# Altium schematic sheet 8_dc_dc_5V_5A_Radio.SchDoc: Radios Step-Down Converters 5V/3A
size A4; DrawnBy: Sara V. Martínez; Engineer: Flight; DocumentNumber: 11; Revision: V0.1; SheetNumber: 11; SheetTotal: 11
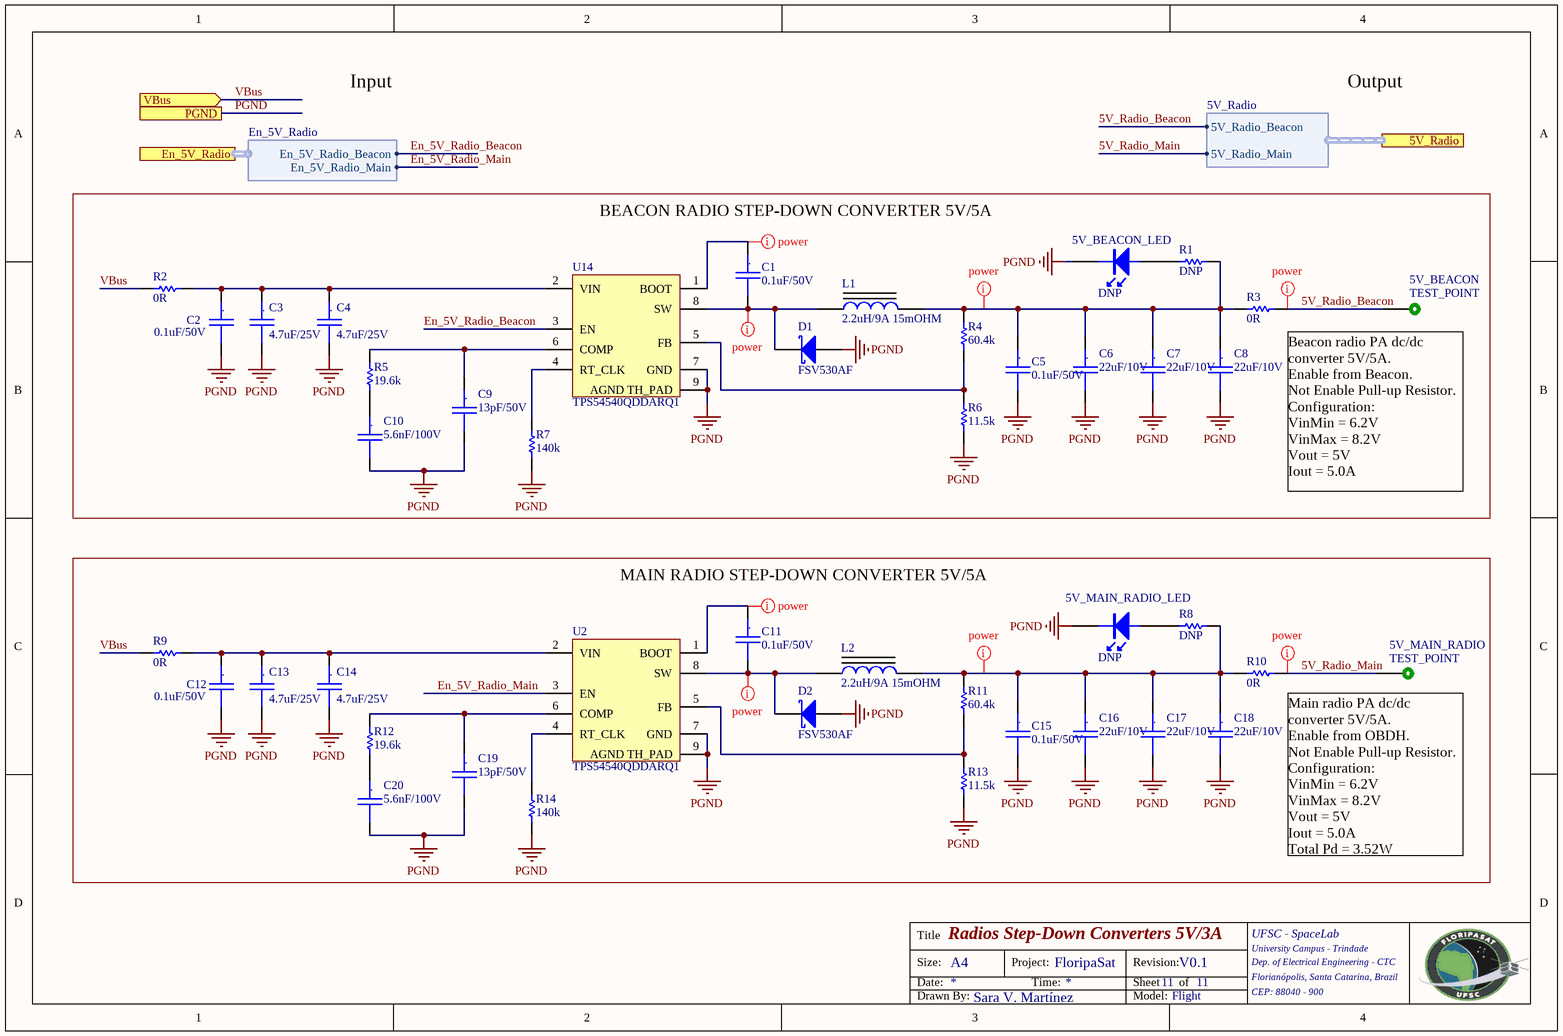
[diagram p0: 8_dc_dc_5V_5A_Radio.SchDoc]

## Parts
5V_BEACON  TEST_POINT  [TEST_POINT]  (no BOM)
5V_BEACON_LED  DNP  [0603-LED]
5V_MAIN_RADIO  TEST_POINT  [TEST_POINT]  (no BOM)
5V_MAIN_RADIO_LED  DNP  [0603-LED]
C1  0.1uF/50V  [CC0805]
C2  0.1uF/50V  [CC0805]
C3  4.7uF/25V  [CC0805]
C4  4.7uF/25V  [CC0805]
C5  0.1uF/50V  [CC0805]
C6  22uF/10V  [CC1206]
C7  22uF/10V  [CC1206]
C8  22uF/10V  [CC1206]
C9  13pF/50V  [CC0603]
C10  5.6nF/100V  [CC0603]
C11  0.1uF/50V  [CC0805]
C12  0.1uF/50V  [CC0805]
C13  4.7uF/25V  [CC0805]
C14  4.7uF/25V  [CC0805]
C15  0.1uF/50V  [CC0805]
C16  22uF/10V  [CC1206]
C17  22uF/10V  [CC1206]
C18  22uF/10V  [CC1206]
C19  13pF/50V  [CC0603]
C20  5.6nF/100V  [CC0603]
D1  FSV530AF  [DO-214AC]
D2  FSV530AF  [DO-214AC]
L1  2.2uH/9A 15mOHM  [Ind_SRP6540]
L2  2.2uH/9A 15mOHM  [Ind_SRP6540]
R1  DNP  [0603]
R2  0R  [1206]
R3  0R  [1206]
R4  60.4k  [0805]
R5  19.6k  [0603]
R6  11.5k  [0805]
R7  140k  [0603]
R8  DNP  [0603]
R9  0R  [1206]
R10  0R  [1206]
R11  60.4k  [0805]
R12  19.6k  [0603]
R13  11.5k  [0805]
R14  140k  [0603]
U2  TPS54540QDDARQ1  [SO8 Power PAD]
U14  TPS54540QDDARQ1  [SO8 Power PAD]

## Blocks framed on the sheet
BEACON RADIO STEP-DOWN CONVERTER 5V/5A: 5V_BEACON 5V_BEACON_LED C1-C10 D1 L1 R1-R7 U14
MAIN RADIO STEP-DOWN CONVERTER 5V/5A: 5V_MAIN_RADIO 5V_MAIN_RADIO_LED C11-C20 D2 L2 R8-R14 U2

## Ports
5V_Radio (harness 5V_Radio), En_5V_Radio (harness En_5V_Radio), PGND, VBus (in)

## Harnesses
5V_Radio: 5V_Radio_Beacon, 5V_Radio_Main
En_5V_Radio: En_5V_Radio_Beacon, En_5V_Radio_Main

## Nets
PGND: 5V_BEACON_LED.2(K) 5V_MAIN_RADIO_LED.2(K) C2.2 C3.2 C4.2 C5.2 C6.2 C7.2 C8.2 C9.2 C10.2 C12.2 C13.2 C14.2 C15.2 C16.2 C17.2 C18.2 C19.2 C20.2 D1.2(A) D2.2(A) R6.1 R7.1 R13.1 R14.1 U2.7(GND) U2.9(AGND_TH_PAD) U14.7(GND) U14.9(AGND_TH_PAD) ; port PGND
5V_Radio_Beacon: 5V_BEACON.1 R3.1 ; port 5V_Radio.5V_Radio_Beacon
5V_Radio_Main: 5V_MAIN_RADIO.1 R10.1 ; port 5V_Radio.5V_Radio_Main
En_5V_Radio_Beacon: U14.3(EN) ; port En_5V_Radio.En_5V_Radio_Beacon
En_5V_Radio_Main: U2.3(EN) ; port En_5V_Radio.En_5V_Radio_Main
VBus: R2.2 R9.2 ; port VBus
Net5V_BEACON_LED_1: 5V_BEACON_LED.1(A) R1.2
Net5V_MAIN_RADIO_LED_1: 5V_MAIN_RADIO_LED.1(A) R8.2
NetC1_1: C1.1 U14.1(BOOT)
NetC1_2: C1.2 D1.1(K) L1.1 U14.8(SW)
NetC2_1: C2.1 C3.1 C4.1 R2.1 U14.2(VIN)
NetC5_1: C5.1 C6.1 C7.1 C8.1 L1.2 R1.1 R3.2 R4.2
NetC9_1: C9.1 R5.2 U14.6(COMP)
NetC10_1: C10.1 R5.1
NetC11_1: C11.1 U2.1(BOOT)
NetC11_2: C11.2 D2.1(K) L2.1 U2.8(SW)
NetC12_1: C12.1 C13.1 C14.1 R9.1 U2.2(VIN)
NetC15_1: C15.1 C16.1 C17.1 C18.1 L2.2 R8.1 R10.2 R11.2
NetC19_1: C19.1 R12.2 U2.6(COMP)
NetC20_1: C20.1 R12.1
NetR4_1: R4.1 R6.2 U14.5(FB)
NetR7_2: R7.2 U14.4(RT_CLK)
NetR11_1: R11.1 R13.2 U2.5(FB)
NetR14_2: R14.2 U2.4(RT_CLK)

## Layout directives
net class power: 5V_Radio_Beacon, 5V_Radio_Main, NetC1_1, NetC1_2, NetC5_1, NetC11_1, NetC11_2, NetC15_1

## Notes on the sheet
- Input
- Output
- Beacon radio PA dc/dc converter 5V/5A.
  Enable from Beacon.
  Not Enable Pull-up Resistor.
  Configuration:
  VinMin = 6.2V
  VinMax = 8.2V
  Vout = 5V
  Iout = 5.0A
  Total Pd = 3.52W
- Main radio PA dc/dc converter 5V/5A.
  Enable from OBDH.
  Not Enable Pull-up Resistor.
  Configuration:
  VinMin = 6.2V
  VinMax = 8.2V
  Vout = 5V
  Iout = 5.0A
  Total Pd = 3.52W
- Title
- Size:
- Date:
- A4
- Project:
- Time:
- FloripaSat
- Revision:
- Sheet
- of
- UFSC - SpaceLab
- University Campus - Trindade
- Dep. of Electrical Engineering - CTC
- Florianópolis, Santa Catarina, Brazil
- Drawn By:
- Model:
- CEP: 88040 - 900
- (in symbol Cap_Cer_C0G_5.6nF_100V_0603) .
- (in symbol Cap_Cer_C0G_13pF_50V_0603) .
- (in symbol Cap_Cer_X7R_0.1uF_50V_0805) .
- (in symbol Cap_Cer_X7R_4.7uF_25V_0805) .
- (in symbol Cap_Cer_X7R_22uF_10V_1206) .

## Library data of the parts
5V_BEACON 5V_MAIN_RADIO = TEST_POINT: Test point
5V_BEACON_LED 5V_MAIN_RADIO_LED = LED/G_0603: SMD Green LED; Partnumber: 150060VS75000; NCM: 8541.40.21
C1 C2 C5 C11 C12 C15 = Cap_Cer_X7R_0.1uF_50V_0805: CAP CER 0.1UF 50V 10% X7R 0805; Partnumber: CC0805KRX7R9BB104
C3 C4 C13 C14 = Cap_Cer_X7R_4.7uF_25V_0805: CAP CER 4.7uF 25V 10% X7R 0805; Partnumber: CC0805KKX7R8BB475; NCM: 8532.24.10
C6-C8 C16-C18 = Cap_Cer_X7R_22uF_10V_1206: CAP CER 22uF 10V 10% X7R 1206; Partnumber: GRM31CR71A226KE15L; NCM: 8532.24.10
C9 C19 = Cap_Cer_C0G_13pF_50V_0603: CAP CER 13PF 50V 0603 NP0; Partnumber: C0603C130J5GAC7867; NCM: 8532.24.10
C10 C20 = Cap_Cer_C0G_5.6nF_100V_0603: CAP CER 5.6nF 100V 0603; Partnumber: C1608C0G2A562J080AE; NCM: 8532.24.10
D1 D2 = DIODE_SCHOTTKY_30V_5A_RB080L-30TE25: DIODE SCHOTTKY 30V 5A DO-214AA; NCM: 8541.10.29; Partnumber: FSV530AF
L1 L2 = IND_POWER_2.2uH_9A_15mR: INDUCTOR 2.2UH 9A SMD; Partnumber: SRP6540-2R2M; NCM: 8504.50.00
R1 R8 = R1.0k_1%_1/8W_0603: RES 1.0K OHM 1/8W 1% 0603; Partnumber: MCT06030C1001FP500; NCM: 8533.21.20
R2 R3 R9 R10 = R0R_JUMPER_3/4W_1206: RES 0.0 OHM 3/4W JUMP 1206; Partnumber: HCJ1206ZT0R00
R4 R11 = R60.4k_1%_1/8W_0805: RES 60.4k OHM 1/8W 1% 0805; Partnumber: ERJ-6ENF6042V; NCM: 8533.21.20
R5 R12 = R19.6k_1%_1/10W_0603: RES 19.6k OHM 1/10W 1% 0603; Partnumber: ERJ-3EKF1962V; NCM: 8533.21.20
R6 R13 = R11.5k_1%_1/8W_0805: RES 11.5k OHM 1/8W 1% 0805; Partnumber: AC0805FR-0711K5L; NCM: 8533.21.20
R7 R14 = R140k_1%_1/5W_0603: RES 140k OHM 1/5W 1% 0603; Partnumber: ERJ-P03F1403V; NCM: 8533.21.20
U2 U14 = TPS54540QDDARQ1: Partnumber: TPS54540QDDARQ1